# EAGLE design pipawelbot (EAGLE 7.1.0)
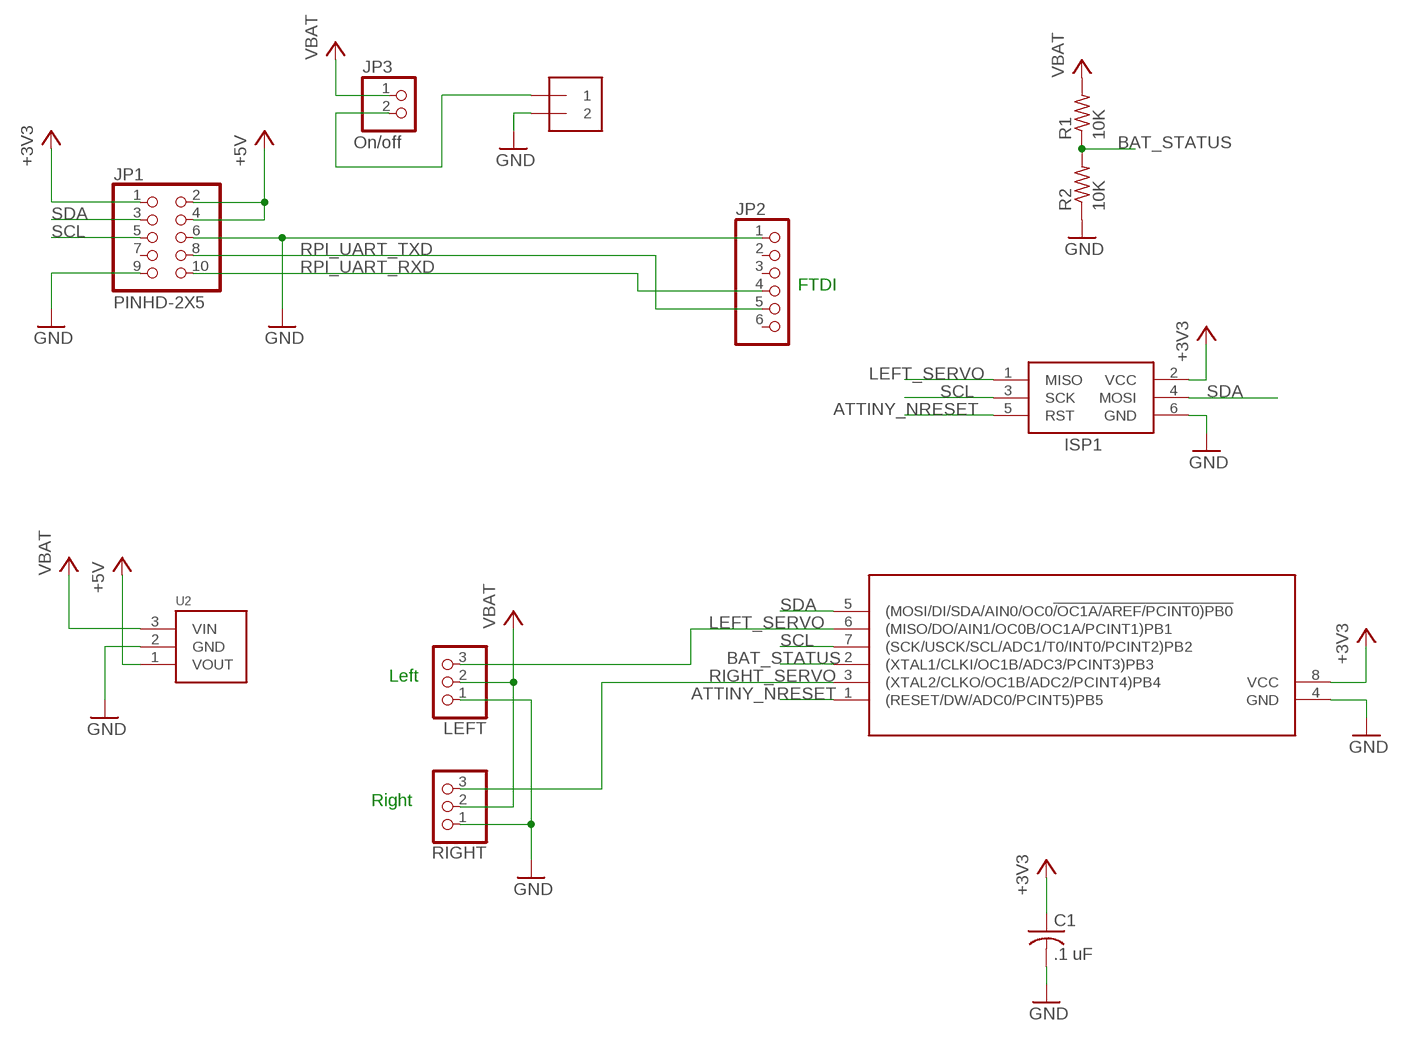
[diagram p0: schematic, sheet 1]

## Parts
C1  .1 uF  C-USC0805  [C0805]
ISP1  AVRISP-6  [AVRISP]
J1  TERMINAL_BLOCK_1X2-2.54MM  [TERMINAL_BLOCK-1X2-0.1]
JP1  PINHD-2X5  [2X5]
JP2  PINHD-1X6  [1X06]
JP3  PINHD-1X2  [1X02]
LEFT  PINHD-1X3  [1X03]
R1  10K  R-US_R0805  [R0805]
R2  10K  R-US_R0805  [R0805]
RIGHT  PINHD-1X3  [1X03]
U1  ATTINY85  [DIL08]
U2  S7V7F5  [POLOLU-REG]

## Nets
+3V3 [VCC]: C1.1 ISP1.2(VCC) JP1.1 U1.8(VCC)
+5V [VCC]: JP1.2 JP1.4 U2.1(VOUT)
ATTINY_NRESET: ISP1.5(RST) U1.1((RESET/DW/ADC0/PCINT5)PB5)
BAT_STATUS: R1.1 R2.2 U1.2((XTAL1/CLKI/OC1B/ADC3/PCINT3)PB3)
GND: C1.2 ISP1.6(GND) J1.1 JP1.6 JP1.9 JP2.1 LEFT.1 R2.1 RIGHT.1 U1.4(GND) U2.2(GND)
LEFT_SERVO: ISP1.1(MISO) LEFT.3 U1.6((MISO/DO/AIN1/OC0B/OC1A/PCINT1)PB1)
RIGHT_SERVO: RIGHT.3 U1.3((XTAL2/CLKO/OC1B/ADC2/PCINT4)PB4)
RPI_UART_RXD: JP1.10 JP2.4
RPI_UART_TXD: JP1.8 JP2.5
SCL: ISP1.3(SCK) JP1.5 U1.7((SCK/USCK/SCL/ADC1/T0/INT0/PCINT2)PB2)
SDA: ISP1.4(MOSI) JP1.3 U1.5((MOSI/DI/SDA/AIN0/OC0!/OC1A/AREF/PCINT0)PB0)
VBAT_IN [VCC]: J1.2 JP3.2
VCC [VCC]: JP3.1 LEFT.2 R1.2 RIGHT.2 U2.3(VIN) ; supply symbol labelled VBAT
Unconnected: JP1.7 JP2.2 JP2.3 JP2.6

## Notes on the sheet
- On/off
- FTDI
- Left
- Right

## Library data of the parts
C1 = adafruit:C-US: CAPACITOR, American symbol
ISP1 = adafruit:AVRISP: AVR ISP HEADER Standard 6 pin header for AVR programming
J1 = sumobot:TERMINAL_BLOCK_1X2: 2.54MM Terminal block Digikey ED10561-ND
JP1 = pipawelbot:PINHD-2X5
JP2 = adafruit:PINHD-1X6: PIN HEADER
JP3 = sumobot:PINHD-1X2: PIN HEADER
LEFT RIGHT = adafruit:PINHD-1X3: PIN HEADER
R1 R2 = adafruit:R-US_: RESISTOR, American symbol
U1 = pipawelbot:ATTINY85
U2 = pipawelbot:S7V7F5: Pololu Regulator

## Net classes
0 default: width 0.305 mm, drill 0.406 mm
1 GND: width 0.406 mm, drill 0.406 mm
2 VCC: width 0.406 mm, drill 0.406 mm

## Board
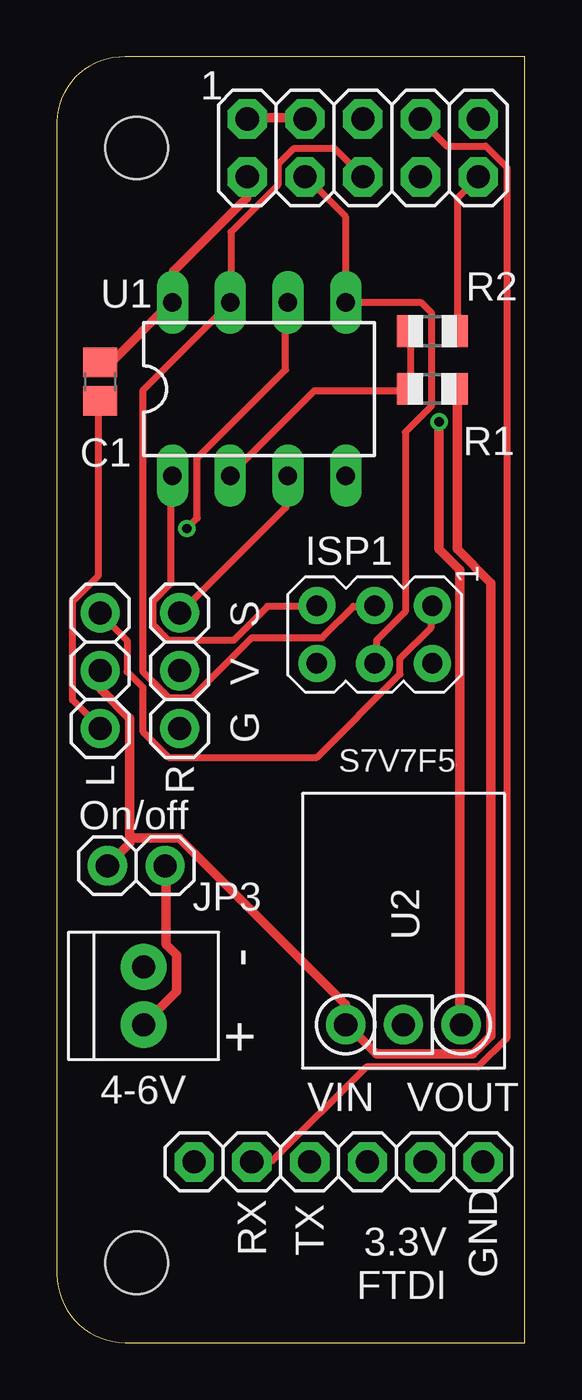
[diagram p1: board, top side]
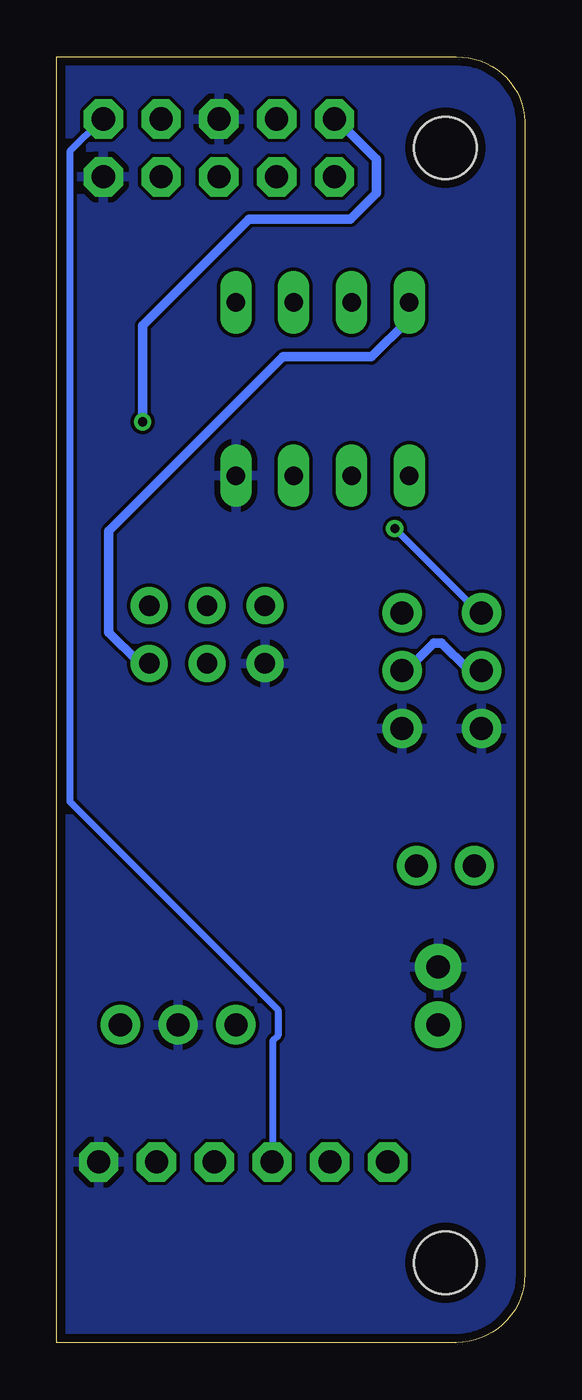
[diagram p2: board, bottom side, seen from below]

Size 20.57 x 56.5 mm. Coordinates in mm from the lower left corner, seen from the top.
Outline: 20.57,56.5 3,56.5 arc90 0,53.64 0,3 arc90 3,0 20.57,0 20.57,56.5
Copper layers (1*16): Top 0.0356mm / dielectric 1.5011mm / Bottom 0.0356mm
Design rules "LaenPCBOrder *": minimum track width 6mil, minimum drill 13mil, track to track 6mil, track to pad 6mil, pad to pad 6mil, via to via 6mil, smd to smd 6mil, copper to edge 15mil, drill to drill 6mil, minimum pad ring 7mil, minimum via ring 7mil, stop-mask expansion 3mil, vias tented up to drill 0mil, thermal gap 10mil
Holes 2.75 mm at 3.5,52.5 3.5,3.5

### Footprints (pad centres in the part's own frame; a part is rotated, then mirrored left to right if it is on the bottom)
C0805 = smd 1.3 x 1.5: 1 -0.85,0; 2 0.85,0
AVRISP = drill 0.9 pad 1.626: 1 -1.27,2.54; 2 1.27,2.54; 3 -1.27,0; 4 1.27,0; 5 -1.27,-2.54; 6 1.27,-2.54
TERMINAL_BLOCK-1X2-0.1 = drill 1.016 pad 2.032: 1 -1.27,0; 2 1.27,0
2X5 = drill 1.016 octagon: 1 -5.08,-1.27; 2 -5.08,1.27; 3 -2.54,-1.27; 4 -2.54,1.27; 5 0,-1.27; 6 0,1.27; 7 2.54,-1.27; 8 2.54,1.27; 9 5.08,-1.27; 10 5.08,1.27
1X06 = drill 1.016 octagon: 1 -6.35,0; 2 -3.81,0; 3 -1.27,0; 4 1.27,0; 5 3.81,0; 6 6.35,0
1X02 = drill 1.016: 1 -2.54,0; 2 0,0
1X03 = drill 1.016: 1 -2.54,0; 2 0,0; 3 2.54,0
R0805 = smd 1.1 x 1.4: 1 -1,0; 2 1,0
DIL08 = drill 0.813 long: 1 -3.81,-3.81; 2 -1.27,-3.81; 3 1.27,-3.81; 4 3.81,-3.81; 5 3.81,3.81; 6 1.27,3.81; 7 -1.27,3.81; 8 -3.81,3.81
POLOLU-REG = drill 1.016: 1 -2.54,0; 2 0,0; 3 2.54,0

### Placement (x,y rotation side)
C1  1.91,42.23 270 top
ISP1  13.97,31.11 270 top
J1  3.81,15.24 270 top
JP1  13.45,52.5 0 top
JP2  12.38,7.94 180 top
JP3  4.76,20.95 0 top
LEFT  1.91,29.53 90 top
R1  16.51,41.91 0 top
R2  16.51,44.45 180 top
RIGHT  5.4,29.53 90 top
U1  8.89,41.91 0 top
U2  15.24,13.97 180 top

### Tracks (layer width: path | path; a pad name or v marks a point on that pad's centre or on a via)
+3V3
  Top 0.406: C1.1 1.94,43.09 2.4,43.09 5.03,45.72 U1.8 5.14,45.83 5.14,47.09 8.34,50.29 8.34,51.21 JP1.1
  Bottom 0.406: ISP1.2 16.57,29.95 17.03,29.95 18.29,31.2 18.29,35.66 10.63,43.32 6.74,43.32 5.14,44.92 5.14,45.72 U1.8
+5V  (via drill 0.41)
  Top 0.406: JP1.2 8.46,53.84 10.86,53.84 JP1.4 | v16.8,40.46 16.8,34.86 17.72,33.95 17.72,14.06 U2.1
  Bottom 0.406: v16.8,40.46 16.8,44.69 12.12,49.38 7.66,49.38 6.51,50.52 6.51,52.01 8.34,53.84 JP1.2
ATTINY_NRESET
  Top 0.305: U1.1 5.03,38.06 5.03,33.38 4.23,32.58 4.23,31.55 4.92,30.86 7.77,30.86 9.26,32.35 11.43,32.35 ISP1.5
BAT_STATUS
  Top 0.305: R2.2 15.54,44.35 15.54,41.95 R1.1 15.43,41.83 11.32,41.83 7.66,38.18 U1.2
GND
  Top 0.305: R2.1 17.6,44.46 17.6,50.29 18.52,51.21 JP1.9 | C1.2 1.83,41.38 1.83,33.72 0.69,32.58 0.69,28.23 1.83,27.09 LEFT.1
  pour Bottom: 20.57,0 3,0 arc-90 0,3 0,53.5 arc-90 3,56.5 20.57,56.5
LEFT_SERVO  (via drill 0.41)
  Top 0.305: v5.71,35.78 6.17,36.23 6.17,38.86 10.06,42.75 10.06,45.72 U1.6 | ISP1.1 16.46,32.35 16.46,31.43 15.09,30.06 15.09,29.38 11.43,25.72 4.92,25.72 3.77,26.86 3.77,28.8 3.09,29.49 3.09,30.86 1.94,32 LEFT.3
  Bottom 0.305: v5.71,35.78 1.94,32 LEFT.3
RIGHT_SERVO
  Top 0.305: U1.3 10.06,38.06 10.06,36.69 5.49,32.12 RIGHT.3
RPI_UART_RXD
  Bottom 0.305: JP2.4 11.09,8 11.09,13.26 10.86,13.49 10.86,14.63 20,23.77 20,52.35 18.63,53.72 JP1.10
RPI_UART_TXD
  Top 0.305: JP2.5 8.57,8 9.49,8 13.6,12.12 18.52,12.12 19.77,13.37 19.77,51.66 18.86,52.58 17.14,52.58 16,53.72 JP1.8
SCL
  Top 0.305: JP1.5 13.37,51.32 12.23,52.46 10.4,52.46 9.72,51.78 9.72,50.86 7.66,48.81 7.66,45.72 U1.7 7.54,45.61 3.77,41.83 3.77,29.49 4.92,28.35 5.94,28.35 8.57,30.98 11.66,30.98 13.03,32.35 13.95,32.35 ISP1.3
SDA
  Top 0.305: JP1.3 10.97,51.21 12.69,49.49 12.69,45.72 U1.5 16,45.72 16.46,45.26 16.46,41.15 15.32,40.01 15.32,32.12 14.06,30.86 14.06,29.95 ISP1.4
VBAT_IN
  Top 0.406: JP3.2 4.8,20.92 4.8,17.49 5.26,17.03 5.26,15.43 3.89,14.06 J1.2
VCC
  Top 0.406: 3.2,22.17 3.2,21.95 2.29,21.03 JP3.1 | 3.2,22.17 3.2,27.43 1.94,28.69 1.94,29.49 LEFT.2 | R1.2 17.6,41.83 17.6,34.86 19.09,33.38 19.09,13.49 18.29,12.69 14.06,12.69 12.8,13.95 U2.3 12.69,14.17 12.69,14.86 5.37,22.17 3.2,22.17
  Bottom 0.406: RIGHT.2 5.37,29.6 5.14,29.6 4,30.75 3.66,30.75 2.52,29.6 1.94,29.6 LEFT.2

### Text on the board
tPlace: 1 | S | V | G | S7V7F5 | - | + | 4-6V | 3.3V / FTDI | RX | TX | GND
tNames: L | R | On/off